# Altium schematic sheet StepperSMPS.SchDoc
size A; SheetNumber: 1; SheetTotal: 1
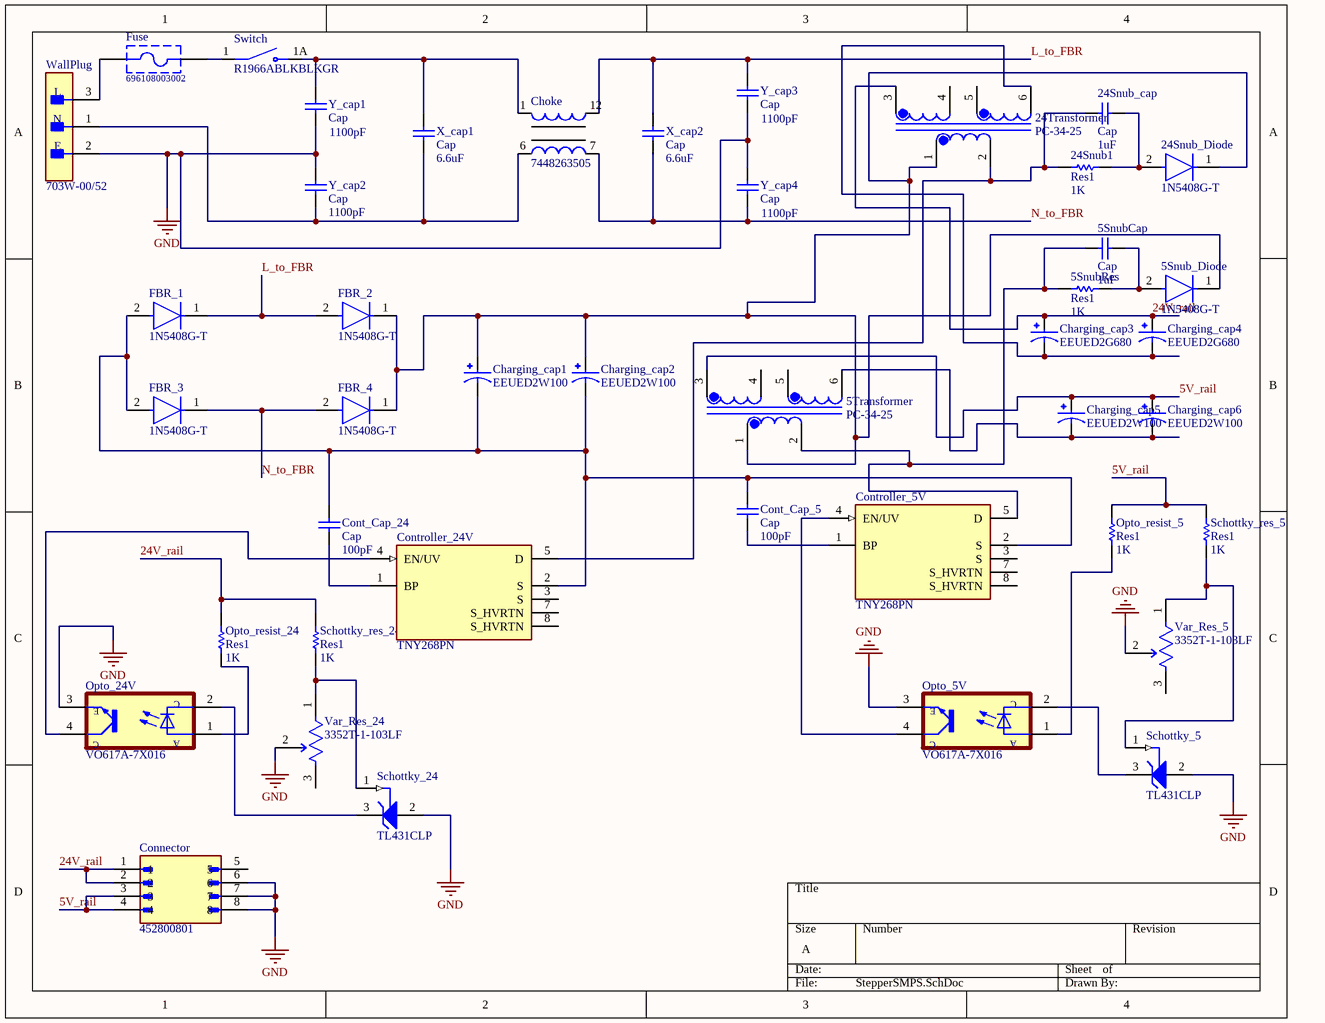
[diagram p0: StepperSMPS.SchDoc]

## Parts
5Snub_Diode  1N5408G-T  [FP-DO-201AD-MFG]
5SnubCap  Cap  value 1uF  [RAD-0.3]
5SnubRes  Res1  value 1K  [AXIAL-0.3]
5Transformer  PC-34-25  [XFMR_PC-34-25]
24Snub1  Res1  value 1K  [AXIAL-0.3]
24Snub_cap  Cap  value 1uF  [RAD-0.3]
24Snub_Diode  1N5408G-T  [FP-DO-201AD-MFG]
24Transformer  PC-34-25  [XFMR_PC-34-25]
Charging_cap1  EEUED2W100  [CAPPRD500W60D1250H2000]
Charging_cap2  EEUED2W100  [CAPPRD500W60D1250H2000]
Charging_cap3  EEUED2G680  [CAPPRD750W80D1800H3150]
Charging_cap4  EEUED2G680  [CAPPRD750W80D1800H3150]
Charging_cap5  EEUED2W100  [CAPPRD500W60D1250H2000]
Charging_cap6  EEUED2W100  [CAPPRD500W60D1250H2000]
Choke  7448263505  [WE-CMB-XXL]
Connector  452800801  [MOLEX_452800801]
Cont_Cap_5  Cap  value 100pF  [RAD-0.3]
Cont_Cap_24  Cap  value 100pF  [RAD-0.3]
Controller_5V  TNY268PN  [DIP762W46P254L957H406Q7]
Controller_24V  TNY268PN  [DIP762W46P254L957H406Q7]
FBR_1  1N5408G-T  [FP-DO-201AD-MFG]
FBR_2  1N5408G-T  [FP-DO-201AD-MFG]
FBR_3  1N5408G-T  [FP-DO-201AD-MFG]
FBR_4  1N5408G-T  [FP-DO-201AD-MFG]
Fuse  696108003002  [696108003002]
Opto_5V  VO617A-7X016  [DIP1016W50P254L458H480Q4]
Opto_24V  VO617A-7X016  [DIP1016W50P254L458H480Q4]
Opto_resist_5  Res1  value 1K  [AXIAL-0.3]
Opto_resist_24  Res1  value 1K  [AXIAL-0.3]
Schottky_5  TL431CLP  [LP0003A]
Schottky_24  TL431CLP  [LP0003A]
Schottky_res_5  Res1  value 1K  [AXIAL-0.3]
Schottky_res_24  Res1  value 1K  [AXIAL-0.3]
Switch  R1966ABLKBLKGR  [SW_R1966ABLKBLKGR]
Var_Res_5  3352T-1-103LF  [FP-3352T-MFG]
Var_Res_24  3352T-1-103LF  [FP-3352T-MFG]
WallPlug  703W-00/52  [FP-703W-00-52-MFG]
X_cap1  Cap  value 6.6uF  [RAD-0.3]
X_cap2  Cap  value 6.6uF  [RAD-0.3]
Y_cap1  Cap  value 1100pF  [RAD-0.3]
Y_cap2  Cap  value 1100pF  [RAD-0.3]
Y_cap3  Cap  value 1100pF  [RAD-0.3]
Y_cap4  Cap  value 1100pF  [RAD-0.3]

## Nets
GND: Connector.6 Connector.7 Connector.8 Opto_5V.3(E) Opto_24V.3(E) Schottky_5.2(ANODE) Schottky_24.2(ANODE) Var_Res_5.2(WIPER) Var_Res_24.2(WIPER) WallPlug.2(E) Y_cap1.1 Y_cap2.2 Y_cap3.1 Y_cap4.2
5V_rail: 5Transformer.3 Charging_cap5.P Charging_cap6.P Connector.3 Connector.4 Opto_resist_5.2 Schottky_res_5.2
24V_rail: 24Transformer.3 Charging_cap3.P Charging_cap4.P Connector.1 Connector.2 Opto_resist_24.2 Schottky_res_24.2
L_to_FBR: Choke.12 FBR_1.1(C) FBR_2.2(A) X_cap2.2 Y_cap3.2
N_to_FBR: Choke.7 FBR_3.1(C) FBR_4.2(A) X_cap2.1 Y_cap4.1
Net5Snub_Diode_1: 5Snub_Diode.1(C) 5Transformer.1 24Snub_Diode.1(C) 24Transformer.1 Charging_cap1.P Charging_cap2.P FBR_2.1(C) FBR_4.1(C)
Net5Snub_Diode_2: 5Snub_Diode.2(A) 5SnubCap.1 5SnubRes.1
Net5SnubCap_2: 5SnubCap.2 5SnubRes.2 5Transformer.2 Controller_5V.5(D)
Net5Transformer_6: 5Transformer.6 Charging_cap5.N Charging_cap6.N
Net24Snub1_1: 24Snub1.1 24Snub_cap.1 24Snub_Diode.2(A)
Net24Snub1_2: 24Snub1.2 24Snub_cap.2 24Transformer.2 Controller_24V.5(D)
Net24Transformer_6: 24Transformer.6 Charging_cap3.N Charging_cap4.N
NetCharging_cap1_N: Charging_cap1.N Charging_cap2.N Cont_Cap_5.2 Cont_Cap_24.2 Controller_5V.2(S) Controller_24V.2(S) FBR_1.2(A) FBR_3.2(A)
NetChoke_1: Choke.1 Switch.1A X_cap1.2 Y_cap1.2
NetChoke_6: Choke.6 WallPlug.1(N) X_cap1.1 Y_cap2.1
NetCont_Cap_5_1: Cont_Cap_5.1 Controller_5V.1(BP)
NetCont_Cap_24_1: Cont_Cap_24.1 Controller_24V.1(BP)
NetController_5V_4: Controller_5V.4(EN/UV) Opto_5V.4(CO)
NetController_24V_4: Controller_24V.4(EN/UV) Opto_24V.4(CO)
NetFuse_1: Fuse.1 WallPlug.3(L)
NetFuse_2: Fuse.2 Switch.1
NetOpto_5V_1: Opto_5V.1(A) Opto_resist_5.1
NetOpto_5V_2: Opto_5V.2(C) Schottky_5.3(CATHODE)
NetOpto_24V_1: Opto_24V.1(A) Opto_resist_24.1
NetOpto_24V_2: Opto_24V.2(C) Schottky_24.3(CATHODE)
NetSchottky_5_1: Schottky_5.1(REF) Schottky_res_5.1 Var_Res_5.1(CCW)
NetSchottky_24_1: Schottky_24.1(REF) Schottky_res_24.1 Var_Res_24.1(CCW)

Not connected (* = marked no-connect by the designer): 5Transformer 4 5; 24Transformer 4 5; Connector 5; Controller_5V 3(S) 7(S_HVRTN) 8(S_HVRTN); Controller_24V 3(S) 7(S_HVRTN) 8(S_HVRTN); Var_Res_5 3(CW); Var_Res_24 3(CW)

## Library data of the parts
5Snub_Diode 24Snub_Diode FBR_1-FBR_4 = CMP-12791-000058-1: DIODE GEN PURP 1KV 3A DO201AD; Element Configuration: Single; Polarity: Standard; Max Reverse Current: 5uA; Reverse Recovery Time: 2us; Max Surge Current: 125A; Forward Voltage: 1.1V; Capacitance: 40pF; Series: -; Average Rectified Current: 3A; Weight: 0.038801oz; Package Quantity: 1200; RoHS Compliant: Yes; Radiation Hardening: No; Mount: Through Hole; Forward Current: 3A; Length: 9.5mm; Min Operating Temperature: -65°C; Height: 5.3mm; Voltage Rating (DC): 1kV; Number of Pins: 2; Lead Free: Lead Free; Reverse Voltage (DC): 1kV; Output Current: 3A; Max Repetitive Reverse Voltage (Vrrm): 1kV; Case/Package: DO-201AD; Peak Non-Repetitive Surge Current: 125A; Current Rating: 3A; Packaging: Tape and Reel; Max Operating Temperature: 150°C; Recovery Time: 2us; Width: 5.3mm; Max Reverse Voltage (DC): 1kV
5SnubCap 24Snub_cap Cont_Cap_5 Cont_Cap_24 X_cap1 X_cap2 Y_cap1-Y_cap4 = Cap: Capacitor; Published: 8-Jun-2000; LatestRevisionDate: 17-Jul-2002; LatestRevisionNote: Re-released for DXP Platform.; PackageReference: RAD-0.3; Publisher: Altium Limited; PackageDescription: Radial Cap, Thru-Hole; 2 Leads; 0.3 in Pin Spacing
5SnubRes 24Snub1 Opto_resist_5 Opto_resist_24 Schottky_res_5 Schottky_res_24 = Res1: Resistor; Published: 8-Jun-2000; LatestRevisionDate: 17-Jul-2002; LatestRevisionNote: Re-released for DXP Platform.; PackageReference: AXIAL-0.3; Publisher: Altium Limited; PackageDescription: Axial Device, Thru-Hole; 2 Leads; 0.3 in Pin Spacing
5Transformer 24Transformer = PC-34-25: Low Power Miniature Transformer | 1VA Power | 115V Input | 10VCT Output Series; MF: {'manufacturer': u'Signal Transformer'}; MP: PC-34-25; Availability: Unavailable; Package: None; Price: None; Value: *
Charging_cap1 Charging_cap2 Charging_cap5 Charging_cap6 = EEUED2W100: ED-A; MF: {'manufacturer': u'Panasonic Electronic'}; Price: None; Availability: Unavailable; Value: *; MP: EEUED2W100; Package: None
Charging_cap3 Charging_cap4 = EEUED2G680: ED-A; MF: {'manufacturer': u'Panasonic'}; Price: None; Availability: Unavailable; Value: *; MP: EEUED2G680; Package: None
Choke = CMP-0223-00098-1: THT Common Mode Power Line Choke WE-CMB, L = 0.50 mH; Inductance: 0.50 mH; ComponentLink1URL: http://www.we-online.com; ComponentLink2Description: Datasheet; PackageReference: WE-CMB-XXL; PackageVersion: 2008; ComponentLink2URL: http://www.we-online.de/katalog/media/pdf/7448263505.pdf; PackageDescription: THT Inductor, 4-Leads, Body 43.5 x 23.5 mm; ComponentLink1Description: Manufacturer Link; DatasheetVersion: ver 2, Aug-2008
Connector = 452800801: MF: {'manufacturer': u'Molex'}; Price: None; Package: None; Availability: Unavailable; Value: *; MP: 452800801
Controller_5V Controller_24V = TNY268PN: Converter Offline Flyback Topology 132kHz DIP-8B; MF: {'manufacturer': u'Power Integrations'}; MP: TNY268PN; Availability: Unavailable; Package: None; Value: *; Price: None
Fuse = CMP-1502-00237-1: WR-FSH Fuse Holder Blocks Fuse Holder Blocks Clip Cover for PCB; Manufacturer: Wurth Elektronik; Fuse Size: 5x20mm; Operating Temperature: -30to120degC; Datasheet URL: https://katalog.we-online.de/em/datasheet/696108003002.pdf; Mounting Technology: THT; Package Reference: 696108003002; Part Number: 696108003002; Manufacturer URL: http://www.we-online.de; Packaging: Box; Publisher: WurthElektronik
Opto_5V Opto_24V = VO617A-7X016: MF: {'manufacturer': u'Vishay'}; MP: VO617A-7X016; Package: None; Price: None; Availability: Unavailable; Value: *
Schottky_5 Schottky_24 = CMP-0366-00032-2: Adjustable Precision Shunt Regulator, 34 ppm / degC, 100 mA, 0 to 70 degC, 3-pin TO-92 (LP), Pb-Free (RoHS); Manufacturer: Texas Instruments; Iout/Iz(Max)(mA): 100; SubFamily: Shunt Voltage Reference; Initial Accuracy @ 25/deg C(%): 2; VO Adj(Max)(V): 36; Temp Coeff(Max)(ppm/ degree C): 92; Temp Coeff(Typ)(ppm/ degree C): 34; Min Iz for Regulation(uA): 600; VO Adj(Min)(V): 2.495; Rating: Military; ComponentLink2Description: Datasheet; PackageReference: LP0003A; ComponentLink1URL: http://www.ti.com/; PackageDescription: Plastic Cylindrical Package, Formed Lead Option (TO-92); Code_JEDEC: TO-226; PartNumber: TL431CLP; ComponentLink2URL: http://www.ti.com/general/docs/lit/getliterature.tsp?genericPartNumber=TL431&fileType=pdf; Eco-Plan: Pb-Free (RoHS); DatasheetVersion: SLVS543M; Mounting Technology: Through Hole; ComponentLink3Description: Package Specification; ComponentLink1Description: Manufacturer URL; PackageVersion: 4040001-2/C; ComponentLink3URL: http://www.ti.com/litv/pdf/msot002a
Switch = R1966ABLKBLKGR: MF: {'manufacturer': u'E-Switch'}; Availability: Unavailable; MP: R1966ABLKBLKGR; Price: None; Package: None; Value: *
Var_Res_5 Var_Res_24 = CMP-07234-000038-1: THUMBWHEEL POT 10K OHM 0.5W TOP; Power Rating: 500mW; Resistance Tolerance: 20%; Voltage Rating: 250V; Number of Turns: 1; Temperature Coefficient: 100ppm/°C; Resistance: 10kR; Weight: 0.01oz; Package Quantity: 100; Color: Black; Contact Plating: Tin; Min Operating Temperature: -55°C; Termination: Pin; Technology: CERMET; Series: Trimpot® 3352 - Open Frame; Military Standard: Not; Packaging: Bag; Depth: 9.53mm; Tolerance: 20%; Length: 8.89mm; Lead Free: Lead Free; Height: 0.15inch; Mount: Through Hole; Max Power Dissipation: 500mW; Radiation Hardening: No; REACH SVHC: No SVHC; Resistor Type: Cermet; Diameter: 8.89mm; Max Operating Temperature: 125°C; Taper: Linear; Width: 8.89mm; RoHS Compliant: Yes
WallPlug = CMP-64678-000001-1: PWR ENT RCPT IEC320-C14 PNL SLDR; Max Voltage Rating (AC): 250V; Approvals: UL; Current Rating: 15A; Number of Poles: 2; Fuse: No; Number of Positions: 3; Gender: Receptacle; Panel Thickness: 0.12inch; Pitch: 7mm; Voltage Rating (AC): 250V; Orientation: Right Angle; Contact Plating: Tin; Mount: Through Hole; Housing Material: Thermoplastic; Current: 15A; Termination: Solder; REACH SVHC: No SVHC; Lead Free: Lead Free; Voltage Rating: 250V; Number of Contacts: 3; Color: Black; Connector Type: Receptacle; Packaging: Bulk; Max Current Rating: 15A; Voltage Rating (DC): 250V; Package Quantity: 100